# EAGLE schematic day0_Navila_18315012 (EAGLE 7.5.0)
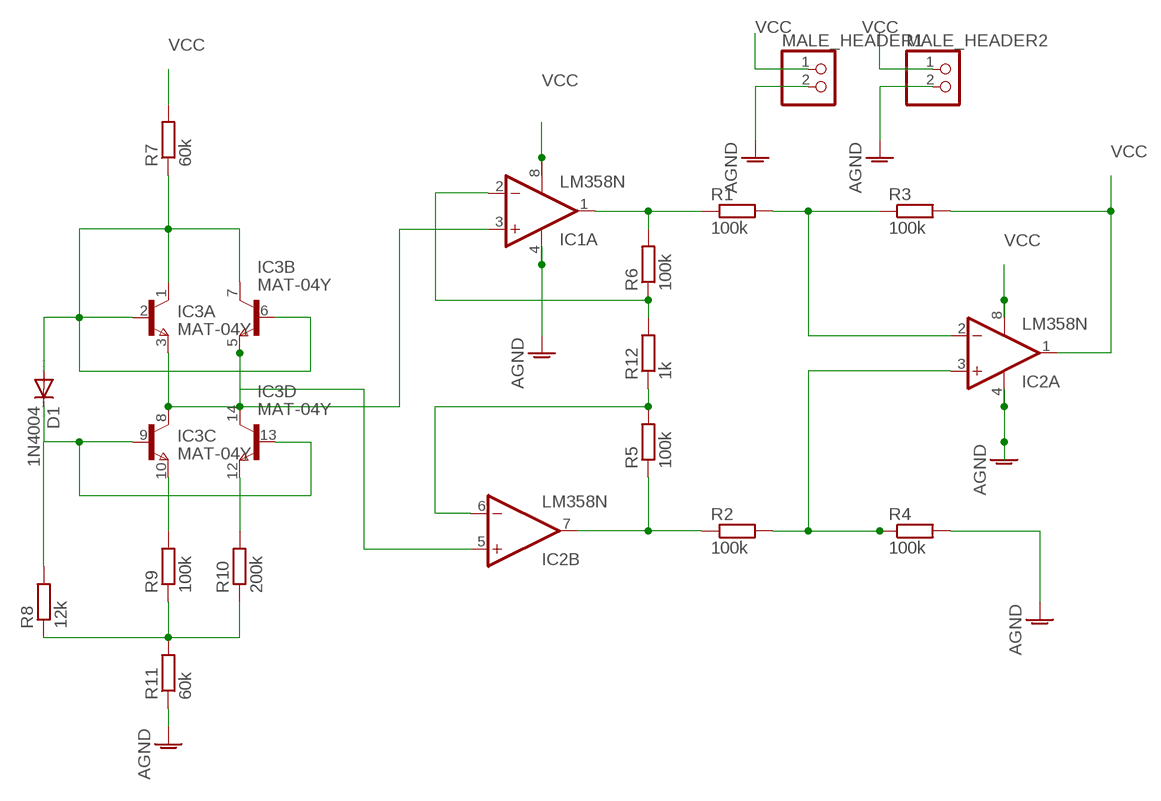
[diagram p0: schematic, sheet 1]

## Parts
D1  1N4004  [DO41-10]
IC1  LM358N  [DIL08]
IC2  LM358N  [DIL08]
IC3  MAT-04Y  [DIL14]
MALE_HEADER1  PINHD-1X2  [1X02]
MALE_HEADER2  PINHD-1X2  [1X02]
R1  100k  R-EU_0204/5  [0204/5]
R2  100k  R-EU_0204/5  [0204/5]
R3  100k  R-EU_0204/5  [0204/5]
R4  100k  R-EU_0204/5  [0204/5]
R5  100k  R-EU_0204/5  [0204/5]
R6  100k  R-EU_0204/5  [0204/5]
R7  60k  R-EU_0204/5  [0204/5]
R8  12k  R-EU_0204/5  [0204/5]
R9  100k  R-EU_0204/5  [0204/5]
R10  200k  R-EU_0204/5  [0204/5]
R11  60k  R-EU_0204/5  [0204/5]
R12  1k  R-EU_0204/5  [0204/5]

## Nets
AGND: IC2.4(P:V-) MALE_HEADER1.2 MALE_HEADER2.2
N$1: D1.A IC3.1(A:C) IC3.2(A:B) IC3.6(B:B) IC3.7(B:C) R7.1
N$2: IC1.4(P:V-) ; supply symbol labelled AGND
N$3: D1.C IC3.9(C:B) IC3.13(D:B) R8.2
N$4: R8.1 R9.1 R10.1 R11.2
N$5: IC2.3(A:+IN) R2.2 R4.1
N$6: IC2.2(A:-IN) R1.2 R3.1
N$8: IC1.3(A:+IN) IC2.5(B:+IN) IC3.3(A:E) IC3.5(B:E) IC3.8(C:C) IC3.14(D:C)
N$9: IC3.12(D:E) R10.2
N$10: IC3.10(C:E) R9.2
N$11: R11.1 ; supply symbol labelled AGND
N$12: IC1.2(A:-IN) R6.1 R12.2
N$13: IC2.6(B:-IN) R5.2 R12.1
N$14: IC1.1(A:OUT) R1.1 R6.2
N$15: IC2.7(B:OUT) R2.1 R5.1
N$16: R4.2 ; supply symbol labelled AGND
VCC: IC1.8(P:V+) IC2.1(A:OUT) IC2.8(P:V+) MALE_HEADER1.1 MALE_HEADER2.1 R3.2 R7.2
Unconnected: IC1.5(B:+IN) IC1.6(B:-IN) IC1.7(B:OUT)

## Library data of the parts
D1 = diode:1N4004: DIODE general purpose rectifier, 1 A
IC1 IC2 = linear:LM358: OP AMP also LM158; LM258; LM2904 Source: http://cache.national.com/ds/LM/LM158.pdf
IC3 = linear:MAT-04: Quad TRANSISTOR
MALE_HEADER1 MALE_HEADER2 = pinhead:PINHD-1X2: PIN HEADER
R1-R12 = resistor:R-EU_: RESISTOR, European symbol